# Altium schematic sheet BannerTestSch.SchDoc
size A
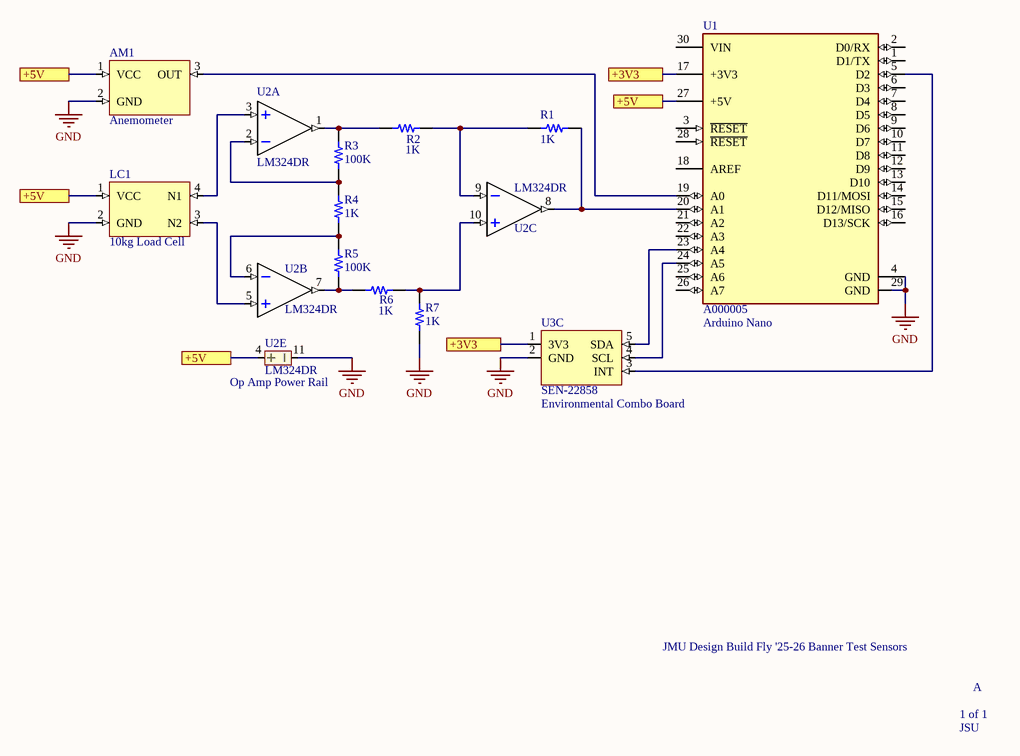
[diagram p0: BannerTestSch.SchDoc]

## Parts
AM1  Anemometer
LC1  10kg Load Cell
R1  1K  [RESC1206(3216)_L]
R2  1K  [RESC1206(3216)_L]
R3  100K  [RESC0603(1608)_L]
R4  1K  [RESC1206(3216)_L]
R5  100K  [RESC0603(1608)_L]
R6  1K  [RESC1206(3216)_L]
R7  1K  [RESC1206(3216)_L]
U1  A000005  [FP-A000005-MFG]
U2  LM324DR  [SOIC-14]  (parts A,B,C,E of 5)
U3  SEN-22858  (part C of 3)

## Ports
+3V3, +5V

## Nets
GND: AM1.2(GND) LC1.2(GND) R7.2 U1.4(GND) U1.29(GND) U2.11(GND) U3.2(GND)
+3V3: U1.17(+3V3) U3.1(3V3) ; port +3V3
+5V: AM1.1(VCC) LC1.1(VCC) U1.27(+5V) U2.4(VCC) ; port +5V
NetAM1_3: AM1.3(OUT) U1.19(A0)
NetLC1_3: LC1.3(N2) U2.5(IN+2)
NetLC1_4: LC1.4(N1) U2.3(IN+1)
NetR1_1: R1.1 R2.2 U2.9(IN-3)
NetR1_2: R1.2 U1.20(A1) U2.8(OUT3)
NetR2_1: R2.1 R3.1 U2.1(OUT1)
NetR3_2: R3.2 R4.1 U2.2(IN-1)
NetR4_2: R4.2 R5.1 U2.6(IN-2)
NetR5_2: R5.2 R6.1 U2.7(OUT2)
NetR6_2: R6.2 R7.1 U2.10(IN+3)
NetU1_5: U1.5(D2) U3.3(INT)
NetU1_23: U1.23(A4) U3.5(SDA)
NetU1_24: U1.24(A5) U3.4(SCL)

Not connected (* = marked no-connect by the designer): U1 1(D1/TX) 2(D0/RX) 3(~{RESET}) 6(D3) 7(D4) 8(D5) 9(D6) 10(D7) 11(D8) 12(D9) 13(D10) 14(D11/MOSI) 15(D12/MISO) 16(D13/SCK) 18(AREF) 21(A2) 22(A3) 25(A6) 26(A7) 28(~{RESET}) 30(VIN)

## Notes on the sheet
- (near U2) Op Amp Power Rail
- (near U1) Arduino Nano
- (near U3) Environmental Combo Board
- JMU Design Build Fly '25-26 Banner Test Sensors
- 1 of 1
- A
- JSU

## Library data of the parts
LC1 = 4542 10kg Load Cell: 10KG Strain Gauge Load Cell, 4 Wire, by Adafruit
R1 R2 R4 R6 R7 = ERJ-8ENF1001V: RES 1.00K OHM 1/4W 1% 1206 SMD; COMSONICS_PN: RW-917; MFG: PANASONIC; COST1K: 0.01; POWER: 0.25W; Tolerance: 1%; MFG_PART_NO: ERJ-8ENF1001V; ROHS: Yes; Resistance: 1K; Category: Resistors; Mounting Type: Surface Mount
R3 R5 = ERJ-3EKF1003V: RES 100K OHM 1/10W 5% 0603 SMD; MFG_PART_NO: MCR03EZPJ104; COMSONICS_PN: RX-555; MFG: ROHM; COST1K: 0.01; ROHS: Yes; Tolerance: 5%; Resistance: 100K; Category: Resistors; Mounting Type: Surface Mount
U1 = CMP-020-00023-1: ATmega328 Microcontroller Development Board 16MHz CPU 2KB RAM 1KB/32KB EEPROM/Flash; Core Architecture: AVR; Operating Supply Voltage: 20V; Memory Size: 32kB; Interface: I2C, SPI, USB; Min Supply Voltage: 7V; Max Supply Voltage: 12V; Data Bus Width: 8b; Number of Bits: 8; Evaluation Kit: Yes; Memory Format: FLASH; Number of I/Os: 22; Nominal Supply Current: 19mA; Height: 6.35mm; Weight: 9.071847g; Width: 127mm; Length: 177.8mm; Frequency: 16MHz; Schedule B: 8542900000, 8542900000; REACH SVHC: No; RoHS: Compliant
U2 = LM324DR: General Purpose Amplifier 4 Circuit  14-SOIC; MFG: Texas Instruments; Common Mode Rejection Ratio: 65dB; Number of Channels: 4; Output Current: 30mA; Max Supply Voltage: 32V; Min Supply Voltage: 3V; Slew Rate: 0.5V/µs; Nominal Supply Current: 3mA; Min Dual Supply Voltage: 1.5V; Max Dual Supply Voltage: 16V; Voltage Gain: 100dB; Input Offset Voltage (Vos): 7mV; Input Bias Current: 250nA; Gain Bandwidth Product: 1.2MHz; Operating Supply Current: 1.4mA; Output Current per Channel: 60mA; Dual Supply Voltage: 9V; COMSONICS_PN: NA; Supplier 1: Mouser; MFG_PART_NO: LM324DR; Stock 1: 0; Pricing 1: 1=0.42, 10=0.339, 50=0.339, 100=0.209, 500=0.173, 1000=0.13, 10000=0.118 (USD); Mount: Surface Mount; Case/Package: SOIC; Number of Pins: 14; Contact Plating: Gold; Min Operating Temperature: 0°C; Max Operating Temperature: 70°C; Package Quantity: 1; Packaging: Tape and Reel; Operating Supply Voltage: 16V; Number of Circuits: 4; Number of Elements: 4; Unity Gain Bandwidth Product: 1.2MHz; Bandwidth: 1.2MHz; Number of Amplifiers: 4; Length: 8.65mm; Width: 3.91mm; Height: 1.58mm; Radiation Hardening: No; Lead Free: Lead Free; RoHS Compliant: Yes; REACH SVHC: No SVHC; ComponentLink1URL: http://www.farnell.com/datasheets/1840878.pdf?src-supplier=Element14; ComponentLink1Description: http://www.farnell.com/datasheets/1840878.pdf?src-supplier=Element14; ComponentLink2URL: http://www.farnell.com/datasheets/1768103.pdf?src-supplier=Farnell; ComponentLink2Description: http://www.farnell.com/datasheets/1768103.pdf?src-supplier=Farnell; ComponentLink3URL: http://www.farnell.com/datasheets/1877076.pdf?src-supplier=Element14; ComponentLink3Description: http://www.farnell.com/datasheets/1877076.pdf?src-supplier=Element14; ComponentLink4URL: http://www.ti.com/lit/ds/symlink/lm224.pdf?src-supplier=Digi-Key; ComponentLink4Description: http://www.ti.com/lit/ds/symlink/lm224.pdf?src-supplier=Digi-Key; ComponentLink5URL: http://www.jameco.com/Jameco/Products/ProdDS/902590.pdf?src-supplier=Jameco; ComponentLink5Description: http://www.jameco.com/Jameco/Products/ProdDS/902590.pdf?src-supplier=Jameco; ComponentLink6URL: http://www.ti.com/general/docs/lit/getliterature.tsp?genericPartNumber=LM124&&fileType=pdf&src-supplier=Avnet; ComponentLink6Description: http://www.ti.com/general/docs/lit/getliterature.tsp?genericPartNumber=LM124&&fileType=pdf&src-supplier=Avnet; Supplier Part Number 1: 595-LM324DR
U3 = SEN-22858: Sparkfun Environmental Combo Bre; Supplier: Mouser; Supplier Part Number: 474-SEN-22858; Manufacturer: SparkFun; Manufacturer Part Number: SEN-22858; Category: Uncategorized; Stock: 32; Pricing: 1=44.94, 10=44.94, 50=44.94, 100=44.94, 1000=44.94, 10000=44.94 (USD)